# Altium schematic sheet Lossless Transmission Line.schdoc: Lossless Transmission Line
size A4; Organization: Altium Limited; Address1: L3, 12a Rodborough Rd; Address2: Frenchs Forest; Address3: NSW; Address4: Australia 2086; DocumentNumber: 1; SheetNumber: 1; SheetTotal: 1
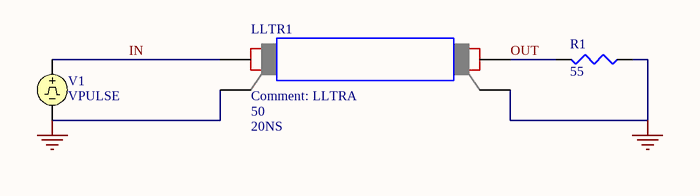
[diagram p0: Lossless Transmission Line.schdoc]

## Parts
LLTR1  LLTRA  Char. Impedance: 50  Transmission Delay: 20NS
R1  55
V1  VPULSE

## Nets
GND: LLTR1.2(N1-) LLTR1.4(N2-) R1.2(BOT) V1.2
IN: LLTR1.1(N1+) V1.1
OUT: LLTR1.3(N2+) R1.1(TOP)

## Notes on the sheet
- Title
- Size:
- Date:
- A4
- Number:
- Time:
- Revision:
- Sheet
- of
- File:

## Library data of the parts
LLTR1 = LLTRA: Lossless Transmission Line
R1 = RES: Resistor; Value: 55
V1 = VPULSE: Pulse Voltage Source